# EAGLE design P00R10 (EAGLE 9.3.0)
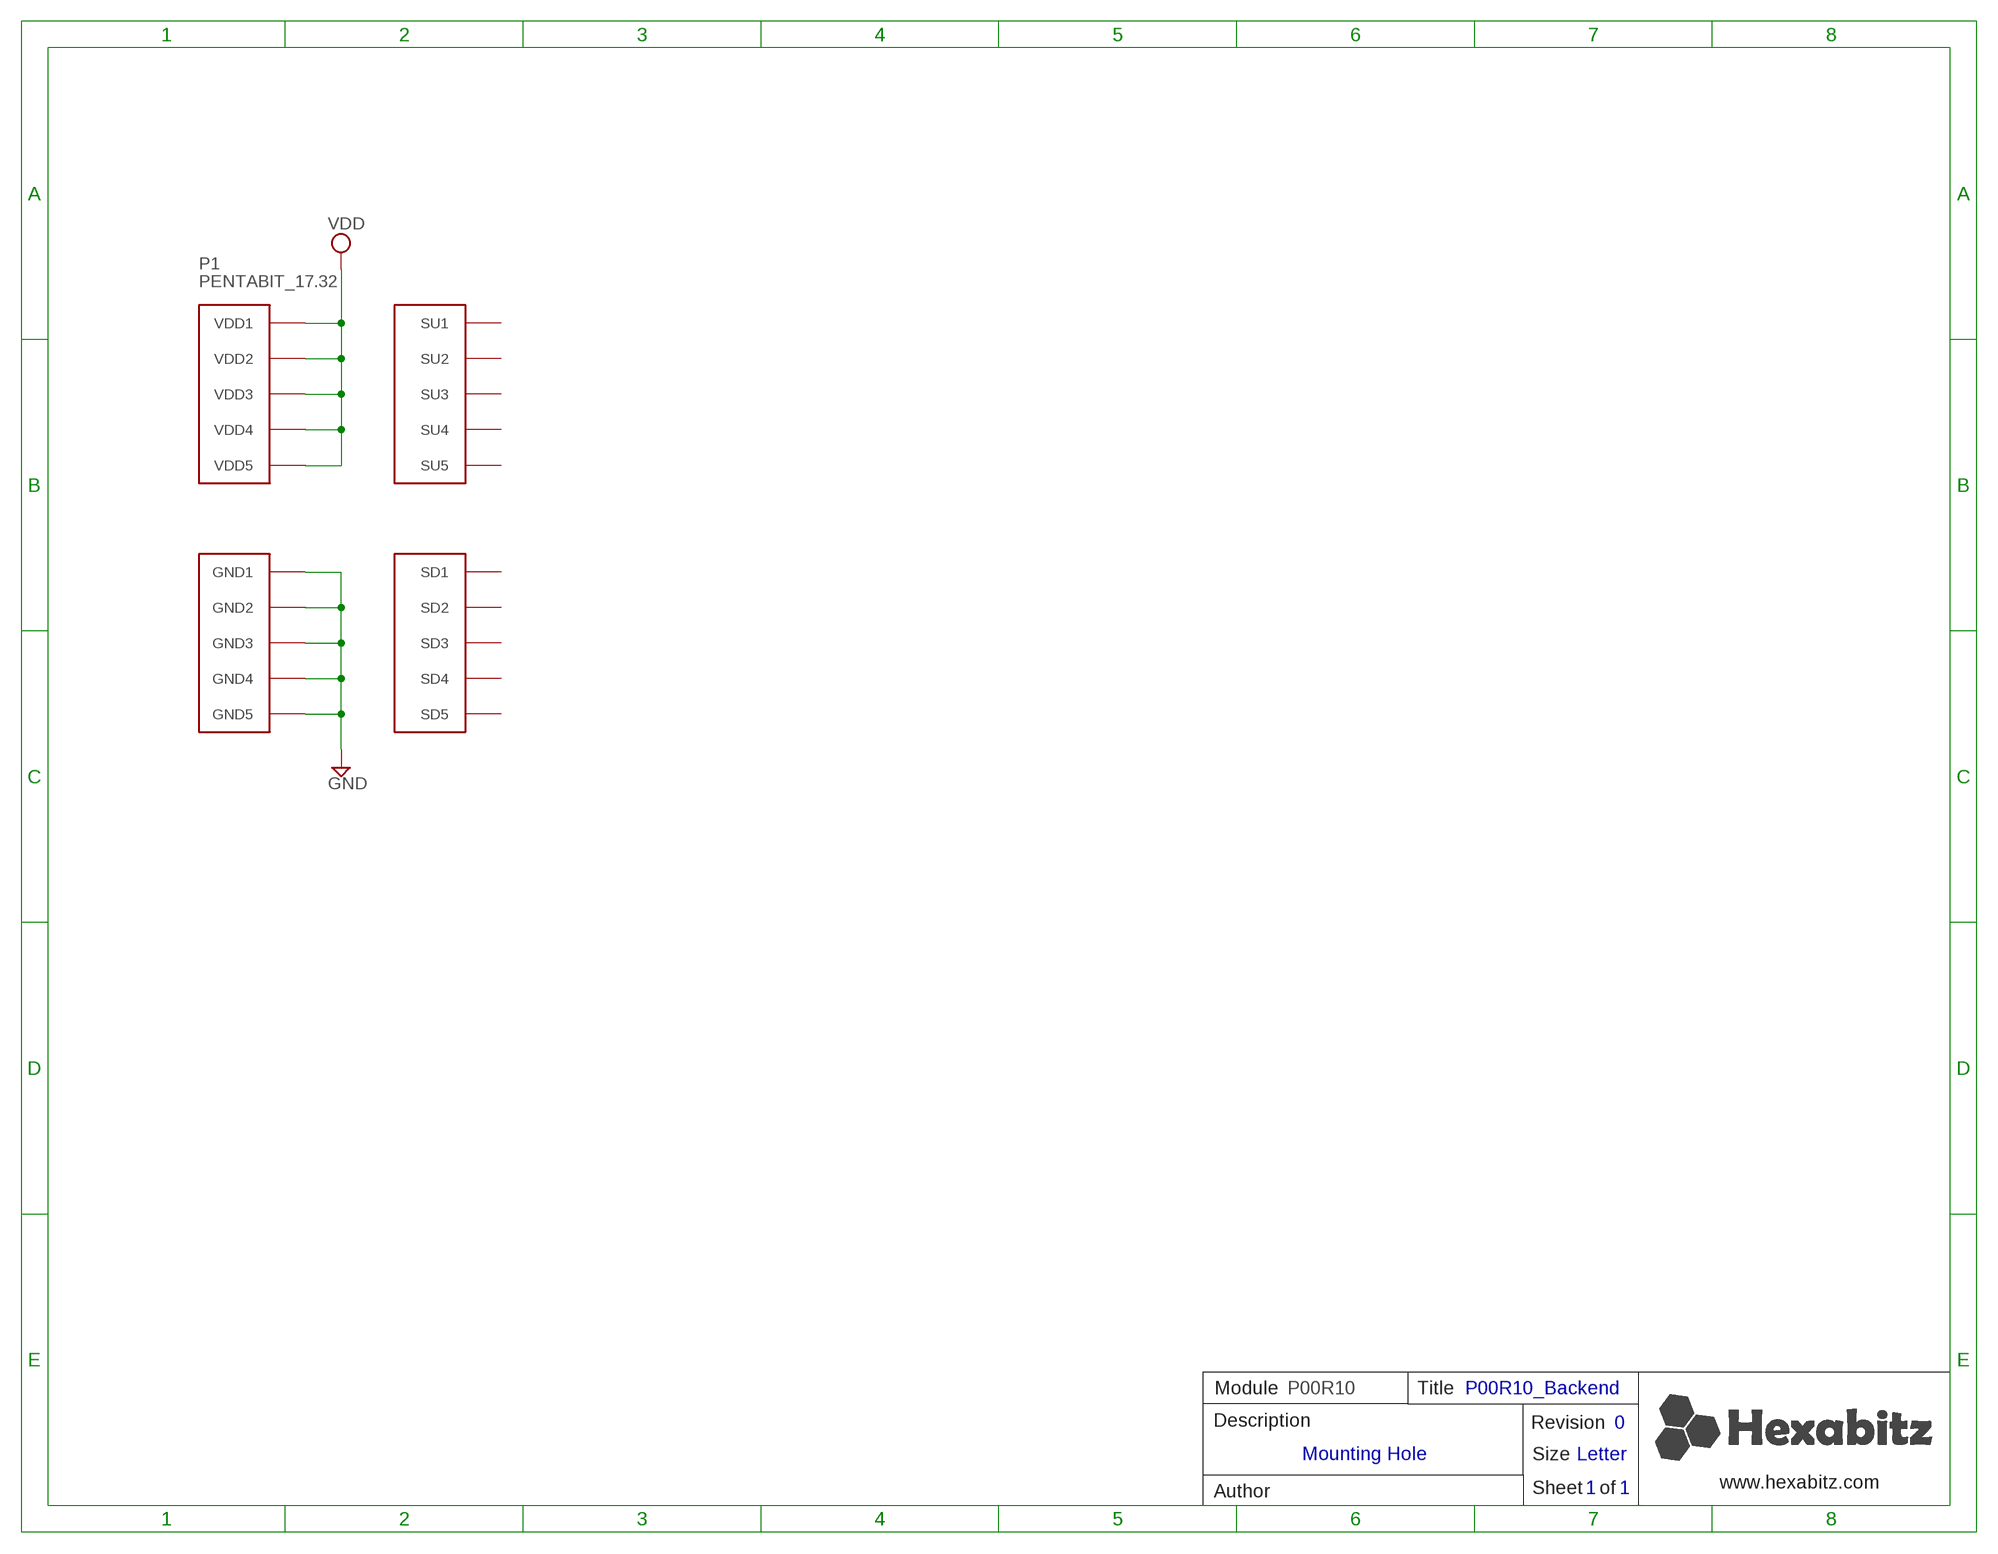
[diagram p0: schematic, sheet 1]

## Parts
P1  PENTABIT_17.32  [PENTABIT_17.32]

## Nets
GND: P1.PAD_PD6(GND1) P1.PAD_PD7(GND2) P1.PAD_PD8(GND3) P1.PAD_PD9(GND4) P1.PAD_PD10(GND5)
VDD: P1.PAD_PU6(VDD1) P1.PAD_PU7(VDD2) P1.PAD_PU8(VDD3) P1.PAD_PU9(VDD4) P1.PAD_PU10(VDD5)
Unconnected: P1.PAD_PD1(SD1) P1.PAD_PD2(SD2) P1.PAD_PD3(SD3) P1.PAD_PD4(SD4) P1.PAD_PD5(SD5) P1.PAD_PU1(SU1) P1.PAD_PU2(SU2) P1.PAD_PU3(SU3) P1.PAD_PU4(SU4) P1.PAD_PU5(SU5)

## Notes on the sheet
- Module | P00R10 | Title | P00R10_Backend
- Description | Revision | 0
- Mounting Hole
- Size | Letter
- www.hexabitz.com
- Author | Sheet   of | 1 | 1
- C:/Users/Admin/Desktop/logodraft.bmp

## Library data of the parts
P1 = hexabitz_connectors:PENTABIT_?: Hexabitz Pentagon Module Connector Pentagon side length = 17.32mm.

## Board
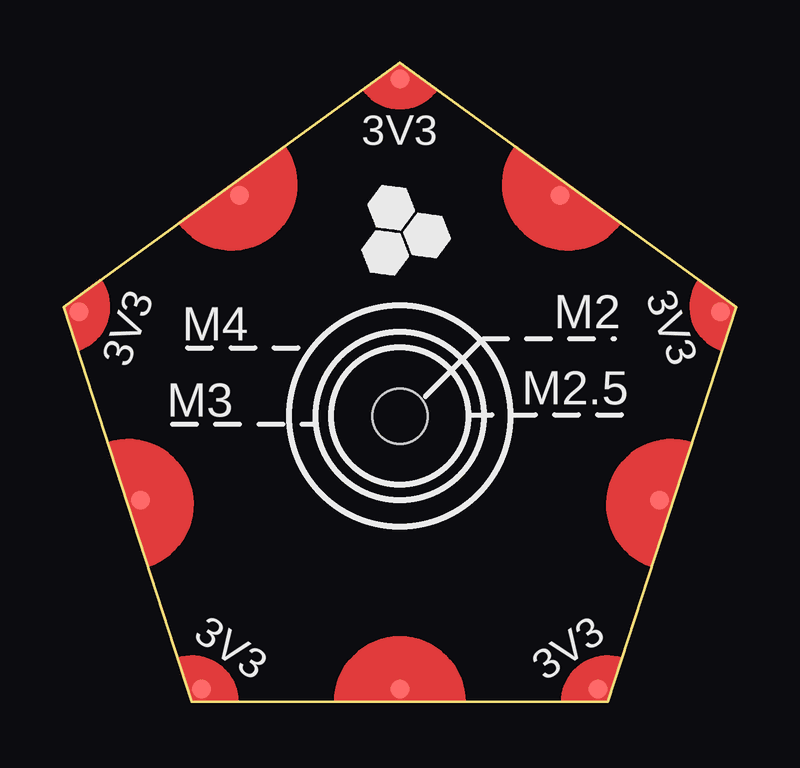
[diagram p1: board, top side]
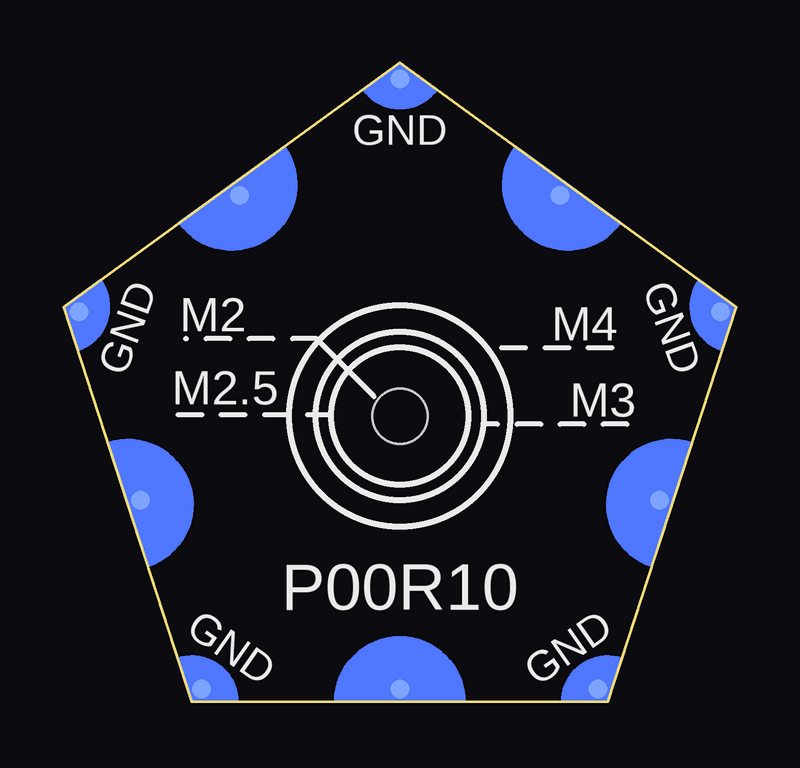
[diagram p2: board, bottom side, seen from below]

Size 28.02 x 26.65 mm. Coordinates in mm from the lower left corner, seen from the top.
Copper layers (1*16): Top 0.035mm / dielectric 1.5mm / Bottom 0.035mm
Design rules "2_layer": minimum track width 7mil, minimum drill 10mil, track to track 6mil, track to pad 6mil, pad to pad 6mil, via to via 6mil, smd to smd 0mil, copper to edge 1mil, drill to drill 8mil, minimum pad ring 10mil, minimum via ring 8mil, stop-mask expansion 2mil, vias tented up to drill 15mil, thermal gap 10mil
Holes 2.3 mm at 14.01,11.92
tRestrict: area 5.9,3.8 to 22.1,20
bRestrict: area 5.9,3.8 to 22.1,20

### Footprints (pad centres in the part's own frame; a part is rotated, then mirrored left to right if it is on the bottom)
PENTABIT_17.32 = smd 0.8 x 0.8 bottom: PAD_PD1 6.68,9.2; PAD_PD2 10.81,-3.51; PAD_PD3 0,-11.37; PAD_PD4 -10.81,-3.51; PAD_PD5 -6.68,9.2; PAD_PD6 0,14.05; PAD_PD7 13.36,4.34; PAD_PD8 8.26,-11.37; PAD_PD9 -8.26,-11.37; PAD_PD10 -13.36,4.34 | smd 0.8 x 0.8: PAD_PU1 6.68,9.2; PAD_PU2 10.81,-3.51; PAD_PU3 0,-11.37; PAD_PU4 -10.81,-3.51; PAD_PU5 -6.68,9.2; PAD_PU6 0,14.05; PAD_PU7 13.36,4.34; PAD_PU8 8.26,-11.37; PAD_PU9 -8.26,-11.37; PAD_PU10 -13.36,4.34

### Placement (x,y rotation side)
P1  14.01,11.92 0 top

### Tracks (layer width: path | path; a pad name or v marks a point on that pad's centre or on a via)
GND
  pour Bottom (isolate 0.102, no thermals): 14.01,26.65 28.02,16.47 22.67,0 5.35,0 0,16.47
VDD
  pour Top (isolate 0.102, no thermals): 14.01,26.65 28.02,16.47 22.67,0 5.35,0 0,16.47

### Text on the board
tPlace: 3V3 | M2 | 3V3 | M4 | 3V3 | M2.5 | M3 | 3V3 | 3V3
bPlace: GND | M2 | GND | M4 | GND | M2.5 | M3 | P00R10 | GND | GND